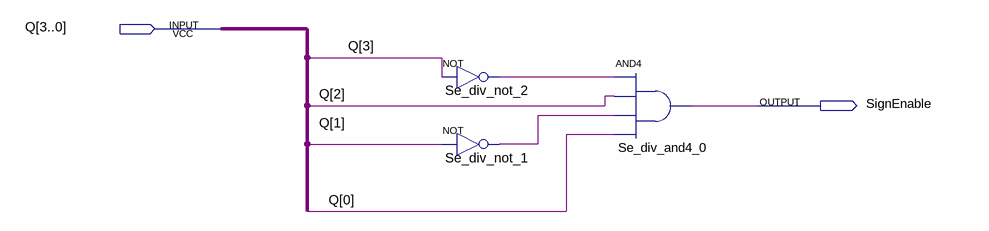
[diagram p0: schematic sheet]
// Quartus schematic SignEnable.bdf as structural Verilog: 3 symbols, 2 pins
module SignEnable (
  input  [3:0] Q,
  output SignEnable
);

  wire Se_div_not_1_out, Se_div_not_2_out;

  not Se_div_not_2 (Se_div_not_2_out, Q[3]);
  not Se_div_not_1 (Se_div_not_1_out, Q[1]);
  and Se_div_and4_0 (SignEnable, Se_div_not_2_out, Q[2], Se_div_not_1_out, Q[0]);
endmodule
